# EAGLE design First Project (EAGLE 9.1.3)
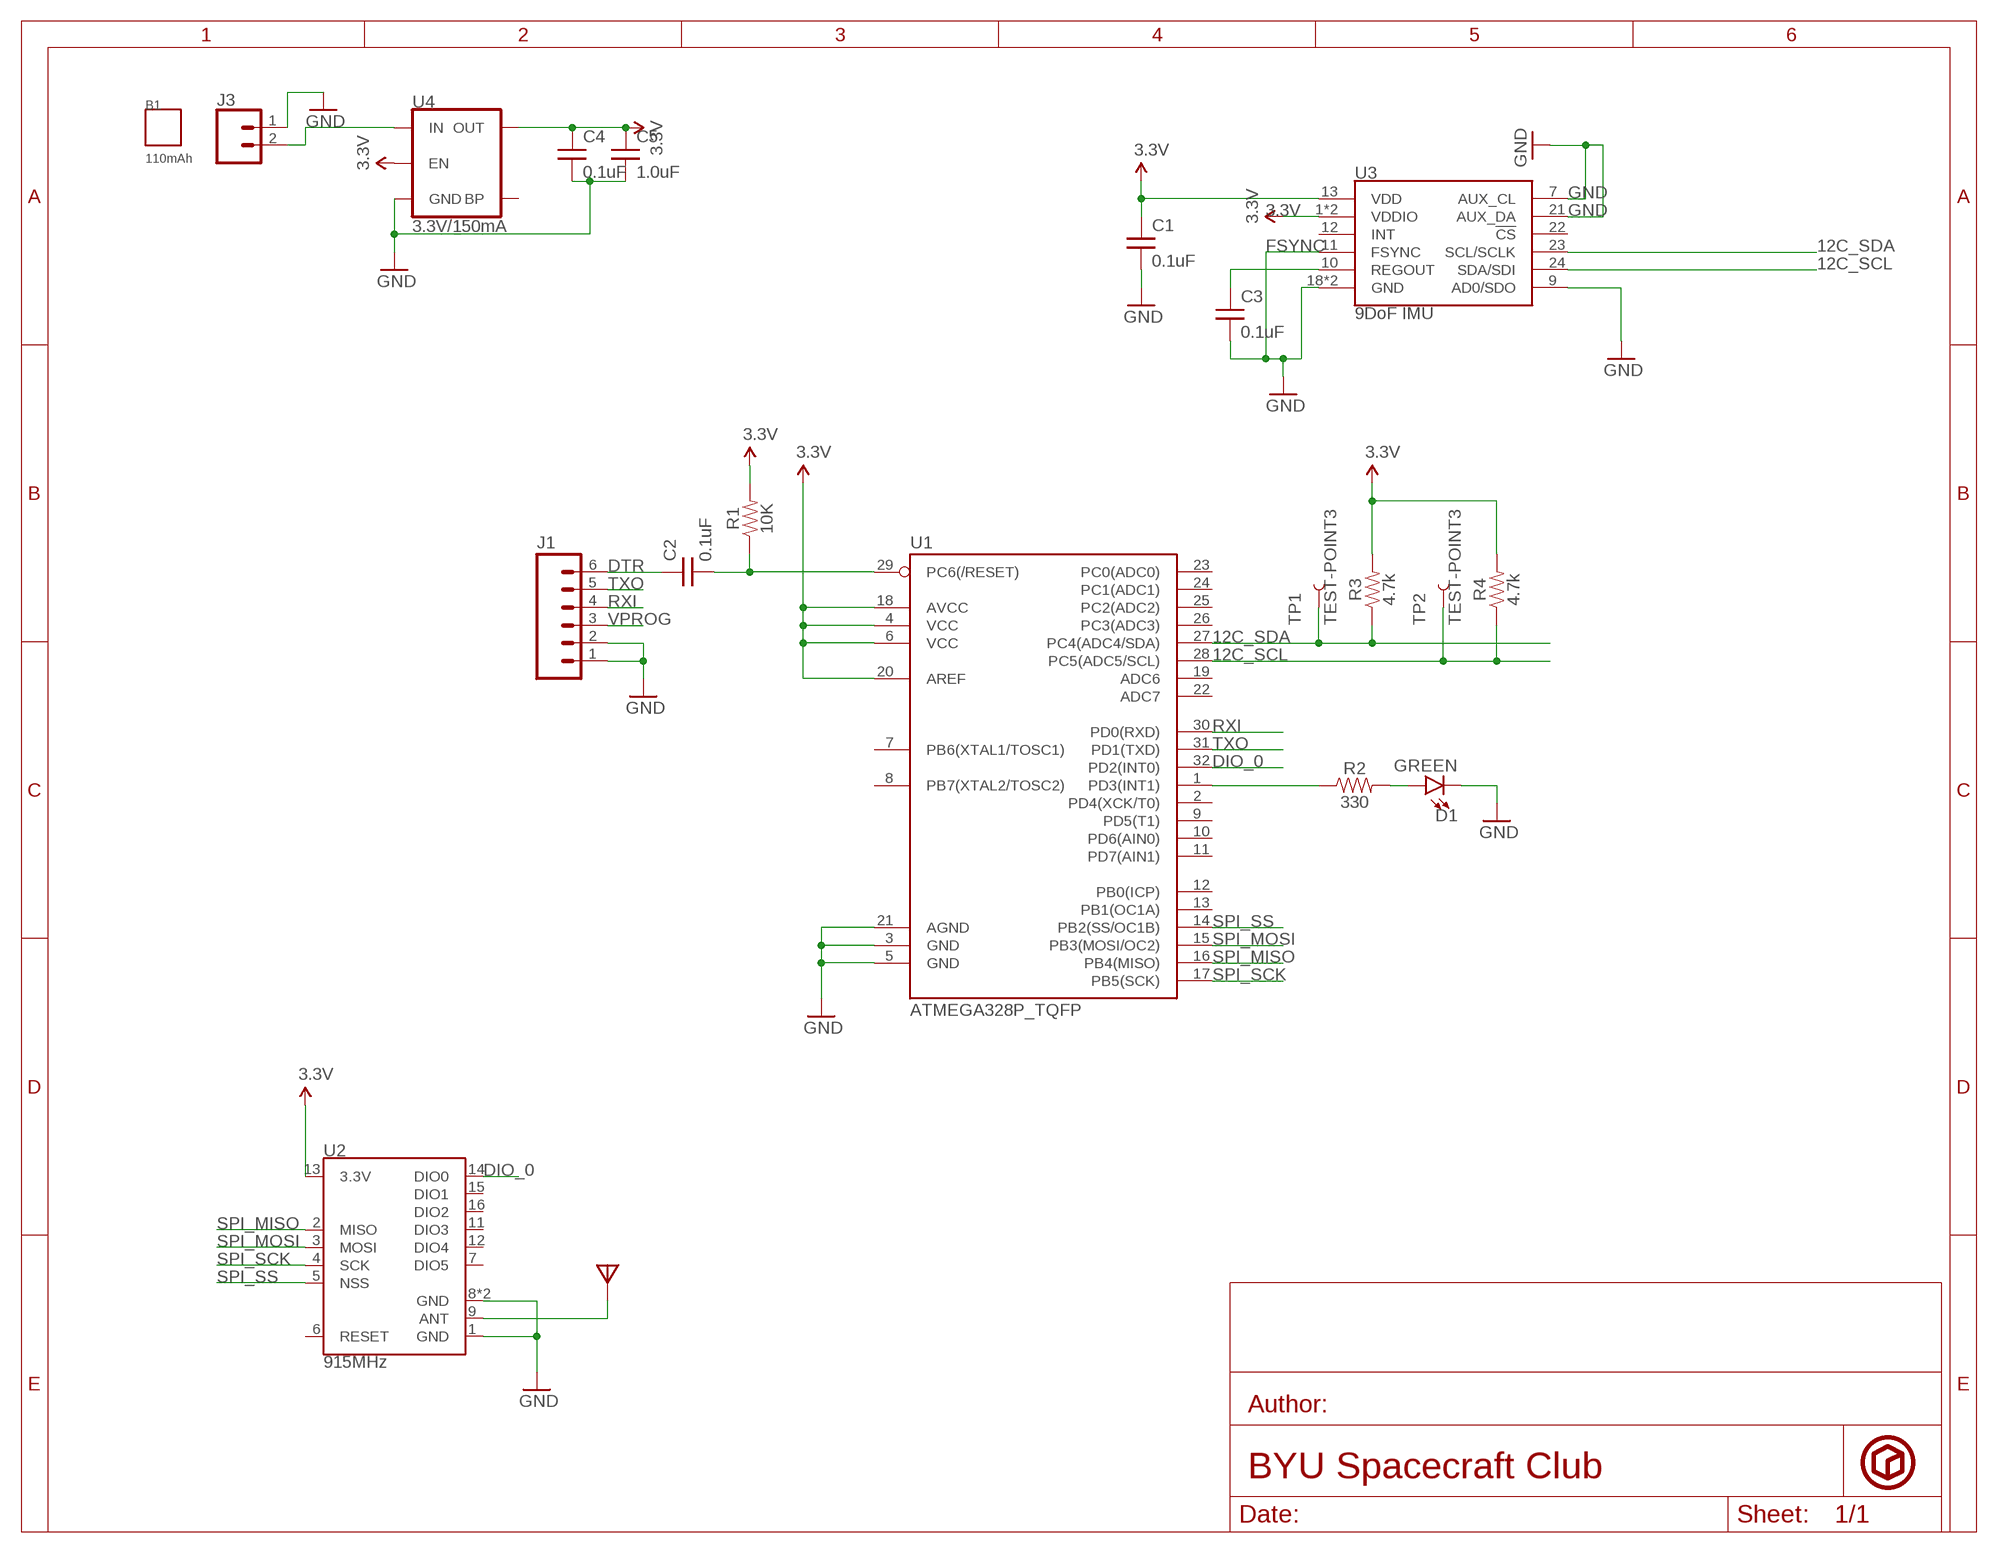
[diagram p0: schematic, sheet 1]

## Parts
ANT1  ANTENNA_PAD  [RFM12B-ANTENNA]
B1  110mAh  BATTERY_FOOTPRINT  [BATT_110MAH]
C1  0.1uF  CAPACITOR_0.1UF  [0603-CAP]
C2  0.1uF  CAPACITOR_0.1UF  [0603-CAP]
C3  0.1uF  CAPACITOR_0.1UF  [0603-CAP]
C4  0.1uF  CAPACITOR_0.1UF  [0603-CAP]
C5  1.0uF  CAPACITOR_1.0UF-0603-16V-10%  [0603]
D1  GREEN  LED_GREEN0603  [LED-0603]
J1  CONNECTOR_6PINSILK_FEMALE_PTH  [1X06]
J3  CONNECTOR_2PIN-JST-2MM-SMT  [JST-2-SMD]
R1  10K  RESISTOR_10KOHM0603  [0603-RES]
R2  330  RESISTOR_330OHM-0603-1/10W-1%  [0603]
R3  4.7k  RESISTOR_4.7KOHM-0603-1/10W-1%  [0603]
R4  4.7k  RESISTOR_4.7KOHM-0603-1/10W-1%  [0603]
TP1  TEST-POINT3  [PAD.03X.03]
TP2  TEST-POINT3  [PAD.03X.03]
U1  ATMEGA328P_TQFP  [TQFP32-08]
U2  915MHz  RADIO_RFM69HCW-915  [RFM69HCW-XXXS2]
U3  9DoF IMU  MPU9250  [QFN24-3X3]
U4  3.3V/150mA  VOLTAGE_REGULATOR_MIC52053.3V  [SOT23-5]

## Nets
3.3V: C1.1 C4.1 C5.1 R1.2 R3.2 R4.2 U1.4(VCC) U1.6(VCC) U1.18(AVCC) U1.20(AREF) U2.13(3.3V) U3.1(VDDIO) U3.8(VDDIO) U3.13(VDD) U4.3(EN) U4.5(OUT)
12C_SCL: R4.1 TP2.P$1 U1.28(PC5(ADC5/SCL)) U3.24(SDA/SDI)
12C_SDA: R3.1 TP1.P$1 U1.27(PC4(ADC4/SDA)) U3.23(SCL/SCLK)
DIO_0: U1.32(PD2(INT0)) U2.14(DIO0)
DTR: C2.1 J1.6
FSYNC: C3.1 U3.10(REGOUT)
GND: C1.2 C3.2 C4.2 C5.2 D1.C J1.1 J1.2 J3.1 U1.3(GND) U1.5(GND) U1.21(AGND) U2.1(GND) U2.8(GND) U2.10(GND) U3.7(AUX_CL) U3.9(AD0/SDO) U3.11(FSYNC) U3.18(GND) U3.20(GND) U3.21(AUX_DA) U4.2(GND)
N$1: C2.2 R1.1 U1.29(PC6(/RESET))
N$2: J3.2 U4.1(IN)
N$3: D1.A R2.2
N$4: ANT1.P$1 U2.9(ANT)
N$9: R2.1 U1.1(PD3(INT1))
RXI: J1.4 U1.30(PD0(RXD))
SPI_MISO: U1.16(PB4(MISO)) U2.2(MISO)
SPI_MOSI: U1.15(PB3(MOSI/OC2)) U2.3(MOSI)
SPI_SCK: U1.17(PB5(SCK)) U2.4(SCK)
SPI_SS: U1.14(PB2(SS/OC1B)) U2.5(NSS)
TXO: J1.5 U1.31(PD1(TXD))
VPROG: J1.3
Unconnected: U1.2(PD4(XCK/T0)) U1.7(PB6(XTAL1/TOSC1)) U1.8(PB7(XTAL2/TOSC2)) U1.9(PD5(T1)) U1.10(PD6(AIN0)) U1.11(PD7(AIN1)) U1.12(PB0(ICP)) U1.13(PB1(OC1A)) U1.19(ADC6) U1.22(ADC7) U1.23(PC0(ADC0)) U1.24(PC1(ADC1)) U1.25(PC2(ADC2)) U1.26(PC3(ADC3)) U2.6(RESET) U2.7(DIO5) U2.11(DIO3) U2.12(DIO4) U2.15(DIO1) U2.16(DIO2) U3.12(INT) U3.22(!CS) U4.4(BP)

## Library data of the parts
ANT1 = femtosat:ANTENNA_PAD: Pad for soldering on a wire antenna
B1 = femtosat:BATTERY_FOOTPRINT: 110mAh Battery Footprint This can be used to show the area a SparkFun 110mAh rechargeable Lithium Battery takes up on a circuit board. It has no schematic connections, just drop it on the schematic and it will put a 25x15mm square box on the PCB. To connect the battery to the circuit use the JST 2 pin connector (CONNECTOR_2PIN) from the femtosat library.; LINK: https://www.sparkfun.com/products/13853
C1-C4 = femtosat:CAPACITOR_0.1UF: CAP-00810 Ceramic Standard decoupling cap; DIGIKEY: 311-1343-1-ND
C5 = femtosat:CAPACITOR_1.0UF: 1µF ceramic capacitors A capacitor is a passive two-terminal electrical component used to store electrical energy temporarily in an electric field.; DIGIKEY: 399-3118-1-ND
D1 = femtosat:LED_GREEN: Green SMD LED Good as an indicator for power or to be controlled by a microcontroller Packages: 0603 - SMD 0603 package [Product Link] <https://www.digikey.com/product-detail/en/lite-on-inc/LTST-C190GKT/160-1183-1-ND/269255> Adapted fromt the SparkFun Libraries; DIGIKEY: 160-1183-1-ND
J1 = femtosat:CONNECTOR_6PIN: 6 pin connection point. Used on the femtosat for a programming connector. The ECEN shop stocks these regularly NOTES ON THE VARIANTS LOCK and LOCK_LONGPADS... This footprint was designed to help hold the alignment of a through-hole component (i.e. 6-pin header) while soldering it into place. You may notice that each hole has been shifted either up or down by 0.005 of an inch from it's more standard position (which is a perfectly straight line). This slight alteration caused the pins (the squares in the middle) to touch the edges of the holes. Because they are alternating, it causes a "brace" to hold the component in place. 0.005 has proven to be the perfect amount of "off-center" position when using our standard breakaway headers. Although looks a little odd when you look at the bare footprint, once you have a header in there, the alteration is very hard to notice. Also, if you push a header all the way into place, it is covered up entirely on the bottom side.
J3 = femtosat:CONNECTOR_2PIN: 2 pin connector 1X02 variant Can be used for soldering on wires or pins. JST-PTH variant is a through hole battery connector for SparkFun batteries JST-SMT variant is a surface mount battery connector for SparkFun batteries; DIGIKEY: 455-1749-1-ND
R1 = femtosat:RESISTOR_10KOHM: 10k Ohm Resistor; DIGIKEY: 311-10KGRCT-ND
R2 = femtosat:RESISTOR_330OHM: 330 Ohm resistor A resistor is a passive two-terminal electrical component that implements electrical resistance as a circuit element. Resistors act to reduce current flow, and, at the same time, act to lower voltage levels within circuits. - Wikipedia; DIGIKEY: 311-330GRCT-ND
R3 R4 = femtosat:RESISTOR_4.7KOHM: 4.7k Ohm resistor A resistor is a passive two-terminal electrical component that implements electrical resistance as a circuit element. Resistors act to reduce current flow, and, at the same time, act to lower voltage levels within circuits. - Wikipedia; DIGIKEY: 311-4.7KGRCT-ND
TP1 TP2 = femtosat:TEST-POINT: Test Points Bare copper test points for troubleshooting or In-Circuit-Testing. These are used by our Production team for verifying production board runs using pogo-pins on test beds. Adapted from SparkFun Libraries
U1 = femtosat:ATMEGA328P_TQFP: ATMEGA 328P Microcontroller in QFP package Adapted from SparkFun libraries; DIGIKEY: ATMEGA328P-AURCT-ND
U2 = femtosat:RADIO_RFM69H: Hope RF RFM69H ISM Transceiver Module The RFM69H is a transceiver module capable of operation over a wide frequency range, including the 315,433,868 and 915MHz license-free ISM (Industry Scientific and Medical) frequency bands. All major RF communication parameters are programmable and most of them can be dynamically set. The RFM69H offers the unique advantage of programmable narrow-band and wide- band communication modes. The RFM69H is optimized for low power consumption while offering high RF output power and channelized operation.Compliance ETSI and FCC regulations. Datasheet <http://www.hoperf.cn/upload/docs/RF/SX/RFM69H_DataSheet_v1.3.pdf> Adapted from SparkFun Libraries; LINK: http://www.anarduino.com/details.jsp?pid=162
U3 = femtosat:MPU9250: MPU-9250 9 Degree of Freedom IMU System in Package that contains MPU-6500 & AK8963 NC pin 19. 2-6 & 14-17 not internally connected. May be used for PCB trace routing. Datasheet <https://cdn.sparkfun.com/assets/learn_tutorials/5/5/0/MPU9250REV1.0.pdf> Adapted from SparkFun Libraries; DIGIKEY: 1428-1019-1-ND
U4 = femtosat:VOLTAGE_REGULATOR_MIC5205: V_REG MIC5205 Standard 3.3V, 5V, and Adjustable 150mA LDO voltage regulator in SOT-23 layout. Micrel part MIC5205. BP (by-pass) pin is used to lower output noise with 470pF cap, may be left open. On the adjustable version BP is used to set output. Adapted from SparkFun Libraries; DIGIKEY: 576-1259-1-ND

## Board
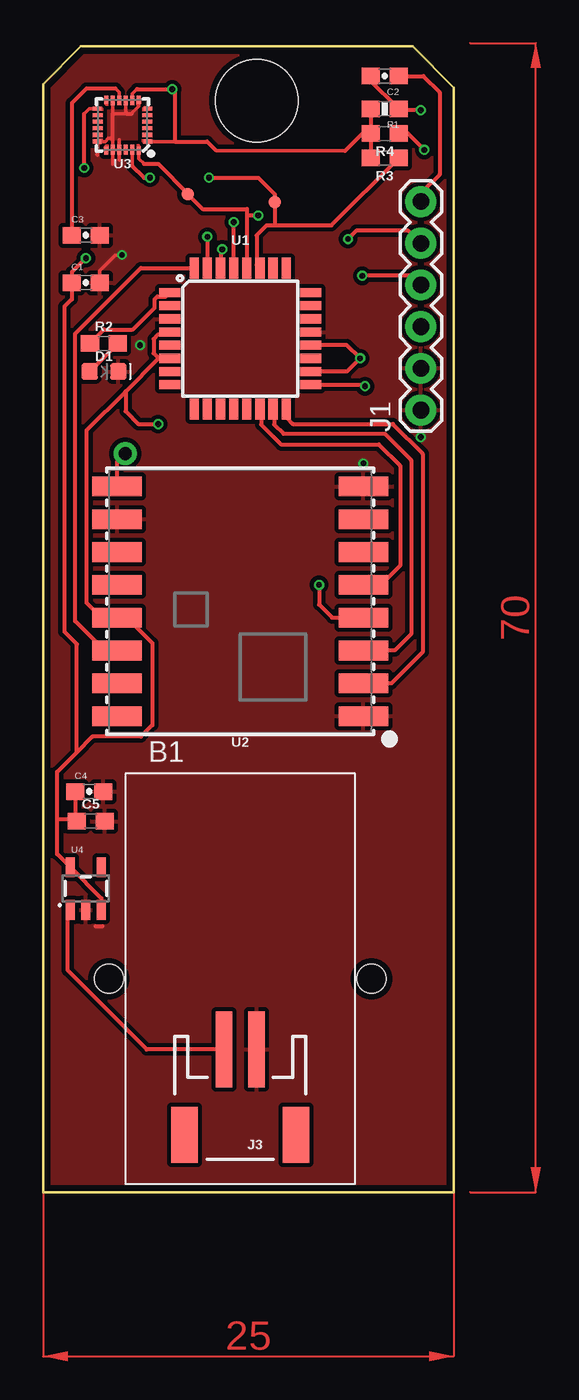
[diagram p1: board, top side]
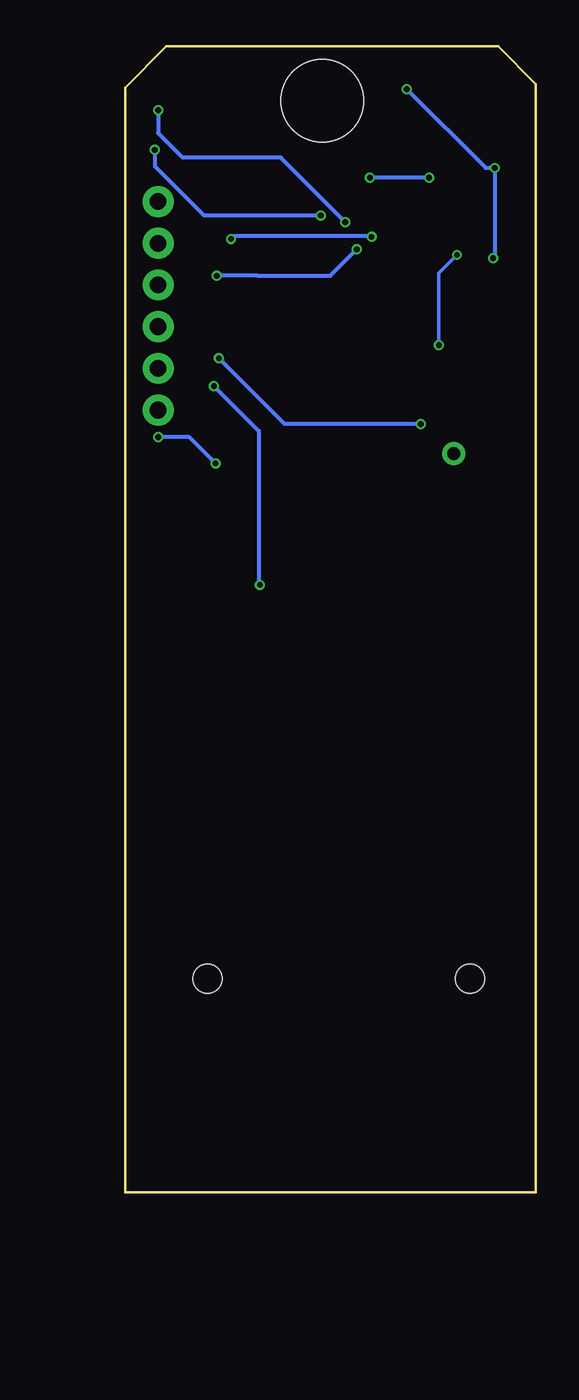
[diagram p2: board, bottom side, seen from below]

Size 25 x 69.8 mm. Coordinates in mm from the lower left corner, seen from the top.
Outline: 0,0 25,0 25,67.3 22.5,69.8 2.3,69.8 0,67.5 0,0
Copper layers (1*16): Top 0.035559375mm / dielectric 1.6mm / Bottom 0.035559375mm
Design rules "oshpark_2layer": minimum track width 6mil, minimum drill 10mil, track to track 6mil, track to pad 6mil, pad to pad 6mil, via to via 6mil, smd to smd 6mil, copper to edge 15mil, drill to drill 6mil, minimum pad ring 5mil, minimum via ring 5mil, stop-mask expansion 2.5mil, vias tented up to drill 0mil, thermal gap 10mil
Holes 5 mm at 13,66.5

### Footprints (pad centres in the part's own frame; a part is rotated, then mirrored left to right if it is on the bottom)
RFM12B-ANTENNA = drill 0.8 pad 1.422: P$1 0,0
BATT_110MAH = hole 1.75: -8,0; 8,0
0603-CAP = smd 1.1 x 1: 1 -0.85,0; 2 0.85,0
0603 = smd 1.1 x 1: 1 -0.85,0; 2 0.85,0
LED-0603 = smd 1 x 1: A -0.877,0; C 0.877,0
1X06 = drill 1.016 pad 1.88: 1 -6.35,0; 2 -3.81,0; 3 -1.27,0; 4 1.27,0; 5 3.81,0; 6 6.35,0
JST-2-SMD = smd 1 x 4.6: 1 -1,-3.7; 2 1,-3.7 | smd 1.6 x 3.4: NC1 -3.4,1.5; NC2 3.4,1.5
0603-RES = smd 1.1 x 1: 1 -0.85,0; 2 0.85,0
PAD.03X.03 = smd 0.762 x 0.762: P$1 0,0
TQFP32-08 = smd 1.27 x 0.559: 1 -4.293,2.8; 2 -4.293,2; 3 -4.293,1.2; 4 -4.293,0.4; 5 -4.293,-0.4; 6 -4.293,-1.2; 7 -4.293,-2; 8 -4.293,-2.8; 17 4.293,-2.8; 18 4.293,-2; 19 4.293,-1.2; 20 4.293,-0.4; 21 4.293,0.4; 22 4.293,1.2; 23 4.293,2; 24 4.293,2.8 | smd 0.559 x 1.27: 9 -2.8,-4.293; 10 -2,-4.293; 11 -1.2,-4.293; 12 -0.4,-4.293; 13 0.4,-4.293; 14 1.2,-4.293; 15 2,-4.293; 16 2.8,-4.293; 25 2.8,4.293; 26 2,4.293; 27 1.2,4.293; 28 0.4,4.293; 29 -0.4,4.293; 30 -1.2,4.293; 31 -2,4.293; 32 -2.8,4.293
RFM69HCW-XXXS2 = smd 3 x 1.2: 1 -7.5,7; 2 -7.5,5; 3 -7.5,3; 4 -7.5,1; 5 -7.5,-1; 6 -7.5,-3; 7 -7.5,-5; 8 -7.5,-7; 9 7.5,-7; 10 7.5,-5; 11 7.5,-3; 12 7.5,-1; 13 7.5,1; 14 7.5,3; 15 7.5,5; 16 7.5,7
QFN24-3X3 = smd 0.495 x 0.25: 1 -1.552,1; 6 -1.552,-1; 13 1.552,-1; 18 1.552,1 | smd 0.6 x 0.25: 2 -1.5,0.6; 3 -1.5,0.2; 4 -1.5,-0.2; 5 -1.5,-0.6; 14 1.5,-0.6; 15 1.5,-0.2; 16 1.5,0.2; 17 1.5,0.6 | smd 0.25 x 0.495: 7 -1,-1.552; 12 1,-1.552; 19 1,1.552; 24 -1,1.552 | smd 0.25 x 0.6: 8 -0.6,-1.5; 9 -0.2,-1.5; 10 0.2,-1.5; 11 0.6,-1.5; 20 0.6,1.5; 21 0.2,1.5; 22 -0.2,1.5; 23 -0.6,1.5
SOT23-5 = smd 0.55 x 1.2: 1 -0.95,-1.3; 2 0,-1.3; 3 0.95,-1.3; 4 0.95,1.3; 5 -0.95,1.3

### Placement (x,y rotation side)
ANT1  5,45 0 top
B1  12,13 0 top
C1  2.6,55.4 0 top
C2  20.8,68 180 top
C3  2.6,58.3 0 top
C4  2.8,24.4 0 top
C5  2.9,22.6 0 top
D1  3.7,50 0 top
J1  23,54 90 top
J3  12,5 180 top
R1  20.8,66 180 top
R2  3.7,51.7 0 top
R3  20.8,63 180 top
R4  20.8,64.5 180 top
TP1  14.1,60.3 0 top
TP2  8.8,60.8 0 top
U1  12,52 0 top
U2  12,36 180 top
U3  4.83,65.01 180 top
U4  2.6,18.5 0 top

### Tracks (layer width: path | path; a pad name or v marks a point on that pad's centre or on a via)
3.3V  (via drill 0.35)
  Top 0.152: 1.95,22.7 C5.1
  Top 0.2: U3.1 8,64.01 | 2.5,65.7 2.81,66.01 U3.13 | U3.8 5.43,66.93 5.7,67.2
  Top 0.254: R4.2 R3.2 | v2.6,56.9 1.75,56.05 C1.1 1.75,54.41 1.3,53.95 1.3,34.15 2.05,33.4 2.05,26.8 | U1.4 7.54,52.23 6.97,52.23 6.72,51.98 6.72,51.12 6.97,50.87 7.64,50.87 U1.6 | 16.22,51.53 U1.20 18.5,51.6 v19.3,50.8 18.5,50 U1.18 16.26,49.97 | U4.3 3.55,17.9 U4.5 0.85,20.6 0.85,22.7 | 7.8,50.8 7.03,50.8 5.02,48.78 | 5.02,48.78 2.65,46.42 2.65,35.9 3.19,35.35 4.15,35.35 U2.13 5.1,35 6.65,33.45 6.65,28.45 5.95,27.75 3,27.75 2.05,26.8 | 0.85,22.7 0.85,25.6 2.05,26.8 | C4.1 1.95,22.7 0.85,22.7 | R4.2 19.45,64.5 18.39,63.44 10.5,63.49 9.99,64.01 8,64.01 8,67.06 v7.86,67.2 5.7,67.2 | R1.2 R4.2 | v2.5,62.4 2.5,65.7 | 5.02,48.78 5.02,47.58 5.8,46.8 v7,46.8
  Top 0.3: U1.6 7.8,50.8
  Bottom 0.254: v2.6,56.9 2.5,57 v2.5,62.4 3.06,62.4 v7.86,67.2 | v7,46.8 15.3,46.8 v19.3,50.8
12C_SCL  (via drill 0.35)
  Top 0.2: 6.14,62.64 5.83,62.96 U3.24
  Top 0.254: 12.4,59.5 U1.28 12.4,59.5 | 12.4,59.5 12.4,59.89 9.71,59.89 TP2.P$1 8.8,60.84 7,62.64 6.5,62.64 6.14,62.64 | v23.2,63.5 22.2,64.5 R4.1 | v13.1,59.5 12.4,59.5
  Bottom 0.254: v13.1,59.5 20.2,59.5 23.2,62.5 v23.2,63.5
12C_SDA  (via drill 0.35)
  Top 0.2: 5.43,62.51 U3.23
  Top 0.254: 5.43,62.51 6.14,61.8 v6.5,61.8 | 14.1,58.9 TP1.P$1 14.1,60.8 13.1,61.8 v10.1,61.8 | U1.27 13,56.49 13,58.3 13.6,58.9 14.1,58.9 | R3.1 17.55,58.9 14.1,58.9 | 5.43,62.51
  Bottom 0.254: v6.5,61.8 v10.1,61.8
DIO_0
  Top 0.254: U2.14 4.45,33.05 3.69,33.05 1.95,34.8 1.95,52.3 5.95,56.3 9.19,56.3 U1.32
DTR
  Top 0.254: C2.1 23.15,68 24.15,67 24.15,62 23,60.85 J1.6
FSYNC
  Top 0.2: 4.41,67.23 4.63,67.01 U3.10
  Top 0.254: C3.1 1.75,66.35 2.63,67.23 4.41,67.23
GND  (via drill 0.35)
  Top 0.2: 4.23,62.63 U3.20 4.23,64 4.23,64.21 3.98,64.21 3.78,64.01 U3.18 | 4.63,62.87 U3.21 4.63,64.13 | U3.11 4.23,65.7 4.96,65.7 5.03,65.77 U3.9 | 5.37,65.7 5.83,66.16 U3.7 | C1.2 3.45,56.15 4.4,57.1 v4.8,57.1
  Top 0.254: 3.6,16.2 3.2,16.2 | 4.23,64.1 4.23,65.7 | 5.03,65.77 5.1,65.7 5.37,65.7 | U3.18 3.28,63.22 3.3,63.2
  Bottom 0.2: v4.8,57.1 5.9,56 v5.9,51.6
  Bottom 0.254: v23,46 21.1,46 v19.5,44.4
  pour Top (isolate 0.254): 0,0 25,0 25,70 0,70
N$1  (via drill 0.35)
  Top 0.254: C2.2 19.81,67.84 R1.1 21.74,65.91 v23,65.91 | U1.29 v11.6,59.1
  Bottom 0.254: v11.6,59.1 15.53,63.03 21.51,63.03 23,64.52 v23,65.91
N$2
  Top 0.254: U4.1 1.5,17.05 1.5,13.5 6.3,8.7 J3.2
N$3
  Top 0.254: R2.2 2.85,50 D1.A
N$4
  Top 0.254: U2.9 4.5,44.5 ANT1.P$1
N$9
  Top 0.254: R2.1 3.7,52.55 5.46,52.55 6.79,53.89 6.79,54.4 6.96,54.56 7.47,54.56 U1.1
RXI  (via drill 0.35)
  Top 0.254: J1.4 22.44,55.83 v19.43,55.83 | v10.9,57.44 10.8,57.44 U1.30
  Bottom 0.254: v10.9,57.44 12.51,55.83 16.43,55.83 16.93,55.83 v19.43,55.83
SPI_MISO
  Top 0.254: U2.2 21.2,31 23.11,32.91 23.11,44.99 21.29,46.81 15.2,46.81 14.8,47.21 U1.16
SPI_MOSI
  Top 0.2: 19.8,33 19.7,33
  Top 0.254: U1.15 14.07,47.64 14.07,46.77 14.64,46.2 20.8,46.2 22.4,44.6 22.4,34 21.4,33 19.7,33 U2.3
SPI_SCK  (via drill 0.35)
  Top 0.254: U1.17 19.5,49.2 v19.6,49.1 | U2.4 17.6,35 16.8,35.8 v16.8,37
  Bottom 0.254: v19.6,49.1 16.87,46.37 16.87,37.07 v16.8,37
SPI_SS
  Top 0.254: U1.14 13.27,47.64 13.27,46.77 14.48,45.55 20.44,45.55 21.73,44.26 21.73,38.17 20.61,37.05 19.55,37.05 U2.5
TXO  (via drill 0.35)
  Top 0.254: J1.5 22.24,58.57 19.06,58.57 v18.56,58.07 | v10,58.2 U1.31
  Bottom 0.254: v18.56,58.07 18.36,58.27 16.56,58.27 10.07,58.27 v10,58.2
(copper drawn outside any net)
  shapes: Top area x2